# Altium schematic sheet CtrlCarbinBoard_NetConnection.SchDoc
size A3
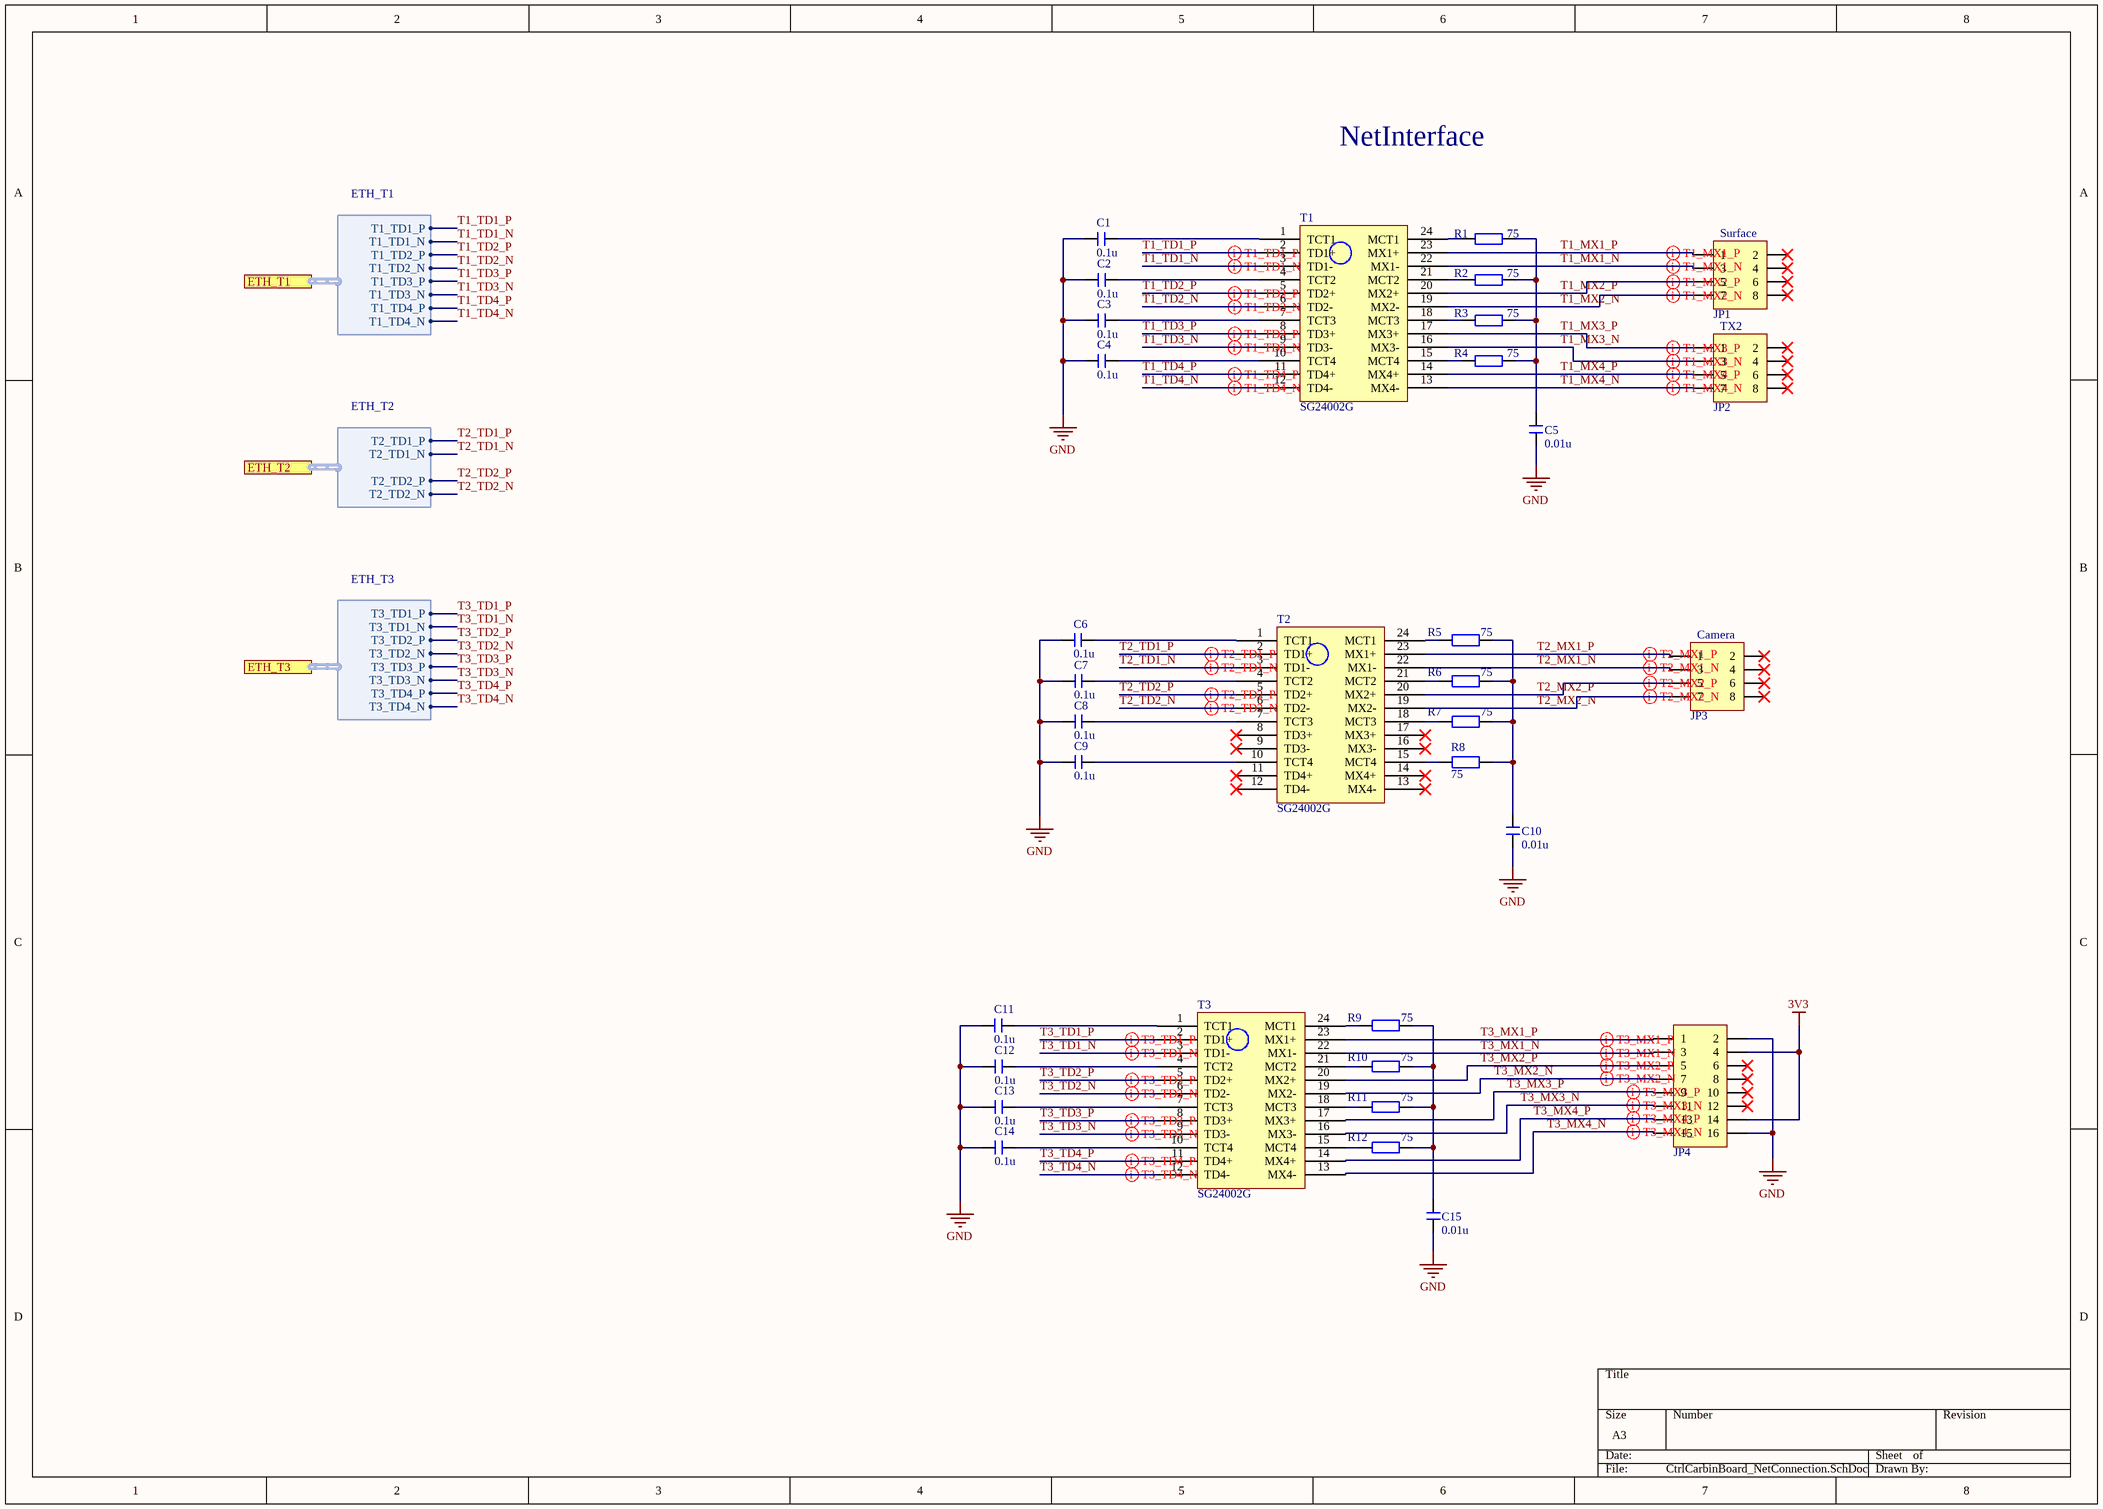
[diagram p0: CtrlCarbinBoard_NetConnection.SchDoc]

## Parts
C1  0.1u  [C 0603_L]
C2  0.1u  [C 0603_L]
C3  0.1u  [C 0603_L]
C4  0.1u  [C 0603_L]
C5  0.01u  [C 0603_M]
C6  0.1u  [C 0603_L]
C7  0.1u  [C 0603_L]
C8  0.1u  [C 0603_L]
C9  0.1u  [C 0603_L]
C10  0.01u  [C 0603_M]
C11  0.1u  [C 0603_L]
C12  0.1u  [C 0603_L]
C13  0.1u  [C 0603_L]
C14  0.1u  [C 0603_L]
C15  0.01u  [C 0603_M]
JP1  Surface  [PHB2.0-LI-2x4P]
JP2  TX2  [PHB2.0-LI-2x4P]
JP3  Camera  [PHB2.0-LI-2x4P]
JP4  Header 8X2  [IDC2.54-LI-2x8P]  (value not drawn)
R1  75  [R 0603_L]
R2  75  [R 0603_L]
R3  75  [R 0603_L]
R4  75  [R 0603_L]
R5  75  [R 0603_L]
R6  75  [R 0603_L]
R7  75  [R 0603_L]
R8  75  [R 0603_L]
R9  75  [R 0603_L]
R10  75  [R 0603_L]
R11  75  [R 0603_L]
R12  75  [R 0603_L]
T1  SG24002G  [SG24002G]
T2  SG24002G  [SG24002G]
T3  SG24002G  [SG24002G]

## Ports
ETH_T1 (harness ETH_T1), ETH_T2 (harness ETH_T2), ETH_T3 (harness ETH_T3)

## Harnesses
ETH_T1: T1_TD1_P, T1_TD1_N, T1_TD2_P, T1_TD2_N, T1_TD3_P, T1_TD3_N, T1_TD4_P, T1_TD4_N
ETH_T2: T2_TD1_P, T2_TD1_N, T2_TD2_P, T2_TD2_N
ETH_T3: T3_TD1_P, T3_TD1_N, T3_TD2_P, T3_TD2_N, T3_TD3_P, T3_TD3_N, T3_TD4_P, T3_TD4_N

## Nets
3V3: JP4.4 JP4.14
GND: C1.1 C2.1 C3.1 C4.1 C5.1 C6.1 C7.1 C8.1 C9.1 C10.1 C11.1 C12.1 C13.1 C14.1 C15.1 JP4.2 JP4.16
T1_MX1_N: JP1.3 T1.22(MX1-)
T1_MX1_P: JP1.1 T1.23(MX1+)
T1_MX2_N: JP1.7 T1.19(MX2-)
T1_MX2_P: JP1.5 T1.20(MX2+)
T1_MX3_N: JP2.3 T1.16(MX3-)
T1_MX3_P: JP2.1 T1.17(MX3+)
T1_MX4_N: JP2.7 T1.13(MX4-)
T1_MX4_P: JP2.5 T1.14(MX4+)
T1_TD1_N: T1.3(TD1-) ; port ETH_T1.T1_TD1_N
T1_TD1_P: T1.2(TD1+) ; port ETH_T1.T1_TD1_P
T1_TD2_N: T1.6(TD2-) ; port ETH_T1.T1_TD2_N
T1_TD2_P: T1.5(TD2+) ; port ETH_T1.T1_TD2_P
T1_TD3_N: T1.9(TD3-) ; port ETH_T1.T1_TD3_N
T1_TD3_P: T1.8(TD3+) ; port ETH_T1.T1_TD3_P
T1_TD4_N: T1.12(TD4-) ; port ETH_T1.T1_TD4_N
T1_TD4_P: T1.11(TD4+) ; port ETH_T1.T1_TD4_P
T2_MX1_N: JP3.3 T2.22(MX1-)
T2_MX1_P: JP3.1 T2.23(MX1+)
T2_MX2_N: JP3.7 T2.19(MX2-)
T2_MX2_P: JP3.5 T2.20(MX2+)
T2_TD1_N: T2.3(TD1-) ; port ETH_T2.T2_TD1_N
T2_TD1_P: T2.2(TD1+) ; port ETH_T2.T2_TD1_P
T2_TD2_N: T2.6(TD2-) ; port ETH_T2.T2_TD2_N
T2_TD2_P: T2.5(TD2+) ; port ETH_T2.T2_TD2_P
T3_MX1_N: JP4.3 T3.22(MX1-)
T3_MX1_P: JP4.1 T3.23(MX1+)
T3_MX2_N: JP4.7 T3.19(MX2-)
T3_MX2_P: JP4.5 T3.20(MX2+)
T3_MX3_N: JP4.11 T3.16(MX3-)
T3_MX3_P: JP4.9 T3.17(MX3+)
T3_MX4_N: JP4.15 T3.13(MX4-)
T3_MX4_P: JP4.13 T3.14(MX4+)
T3_TD1_N: T3.3(TD1-) ; port ETH_T3.T3_TD1_N
T3_TD1_P: T3.2(TD1+) ; port ETH_T3.T3_TD1_P
T3_TD2_N: T3.6(TD2-) ; port ETH_T3.T3_TD2_N
T3_TD2_P: T3.5(TD2+) ; port ETH_T3.T3_TD2_P
T3_TD3_N: T3.9(TD3-) ; port ETH_T3.T3_TD3_N
T3_TD3_P: T3.8(TD3+) ; port ETH_T3.T3_TD3_P
T3_TD4_N: T3.12(TD4-) ; port ETH_T3.T3_TD4_N
T3_TD4_P: T3.11(TD4+) ; port ETH_T3.T3_TD4_P
NetC1_2: C1.2 T1.1(TCT1)
NetC2_2: C2.2 T1.4(TCT2)
NetC3_2: C3.2 T1.7(TCT3)
NetC4_2: C4.2 T1.10(TCT4)
NetC5_2: C5.2 R1.2 R2.2 R3.2 R4.2
NetC6_2: C6.2 T2.1(TCT1)
NetC7_2: C7.2 T2.4(TCT2)
NetC8_2: C8.2 T2.7(TCT3)
NetC9_2: C9.2 T2.10(TCT4)
NetC10_2: C10.2 R5.2 R6.2 R7.2 R8.2
NetC11_2: C11.2 T3.1(TCT1)
NetC12_2: C12.2 T3.4(TCT2)
NetC13_2: C13.2 T3.7(TCT3)
NetC14_2: C14.2 T3.10(TCT4)
NetC15_2: C15.2 R9.2 R10.2 R11.2 R12.2
NetR1_1: R1.1 T1.24(MCT1)
NetR2_1: R2.1 T1.21(MCT2)
NetR3_1: R3.1 T1.18(MCT3)
NetR4_1: R4.1 T1.15(MCT4)
NetR5_1: R5.1 T2.24(MCT1)
NetR6_1: R6.1 T2.21(MCT2)
NetR7_1: R7.1 T2.18(MCT3)
NetR8_1: R8.1 T2.15(MCT4)
NetR9_1: R9.1 T3.24(MCT1)
NetR10_1: R10.1 T3.21(MCT2)
NetR11_1: R11.1 T3.18(MCT3)
NetR12_1: R12.1 T3.15(MCT4)

Not connected (* = marked no-connect by the designer): JP1 2* 4* 6* 8*; JP2 2* 4* 6* 8*; JP3 2* 4* 6* 8*; JP4 6* 8* 10* 12*; T2 8(TD3+)* 9(TD3-)* 11(TD4+)* 12(TD4-)* 13(MX4-)* 14(MX4+)* 16(MX3-)* 17(MX3+)*

## Layout directives
differential pair: T1_MX1_N, T1_MX1_P, T1_MX2_N, T1_MX2_P, T1_MX3_N, T1_MX3_P, T1_MX4_N, T1_MX4_P, T1_TD1_N, T1_TD1_P, T1_TD2_N, T1_TD2_P, T1_TD3_N, T1_TD3_P, T1_TD4_N, T1_TD4_P, T2_MX1_N, T2_MX1_P, T2_MX2_N, T2_MX2_P, T2_TD1_N, T2_TD1_P, T2_TD2_N, T2_TD2_P, T3_MX1_N, T3_MX1_P, T3_MX2_N, T3_MX2_P, T3_MX3_N, T3_MX3_P, T3_MX4_N, T3_MX4_P, T3_TD1_N, T3_TD1_P, T3_TD2_N, T3_TD2_P, T3_TD3_N, T3_TD3_P, T3_TD4_N, T3_TD4_P

## Notes on the sheet
- NetInterface

## Library data of the parts
C1-C15 = C: 无极性贴片电容; 版权归属: 源创客; BOM名称: 无极性贴片电容; 学习资源: www.ooocke.com
JP1-JP3 = Header 4X2: 4*2P接插件; 版权归属: 源创客; BOM名称: 4*2P接插件; 学习资源: www.ooocke.com
JP4 = Header 8X2: 8*2P接插件; 版权归属: 源创客; BOM名称: 8*2P接插件; 学习资源: www.ooocke.com
R1-R12 = R: 贴片电阻; 版权归属: 源创客; BOM名称: 贴片电阻; 学习资源: www.ooocke.com